# Altium schematic sheet AutoCar.SchDoc
size A3
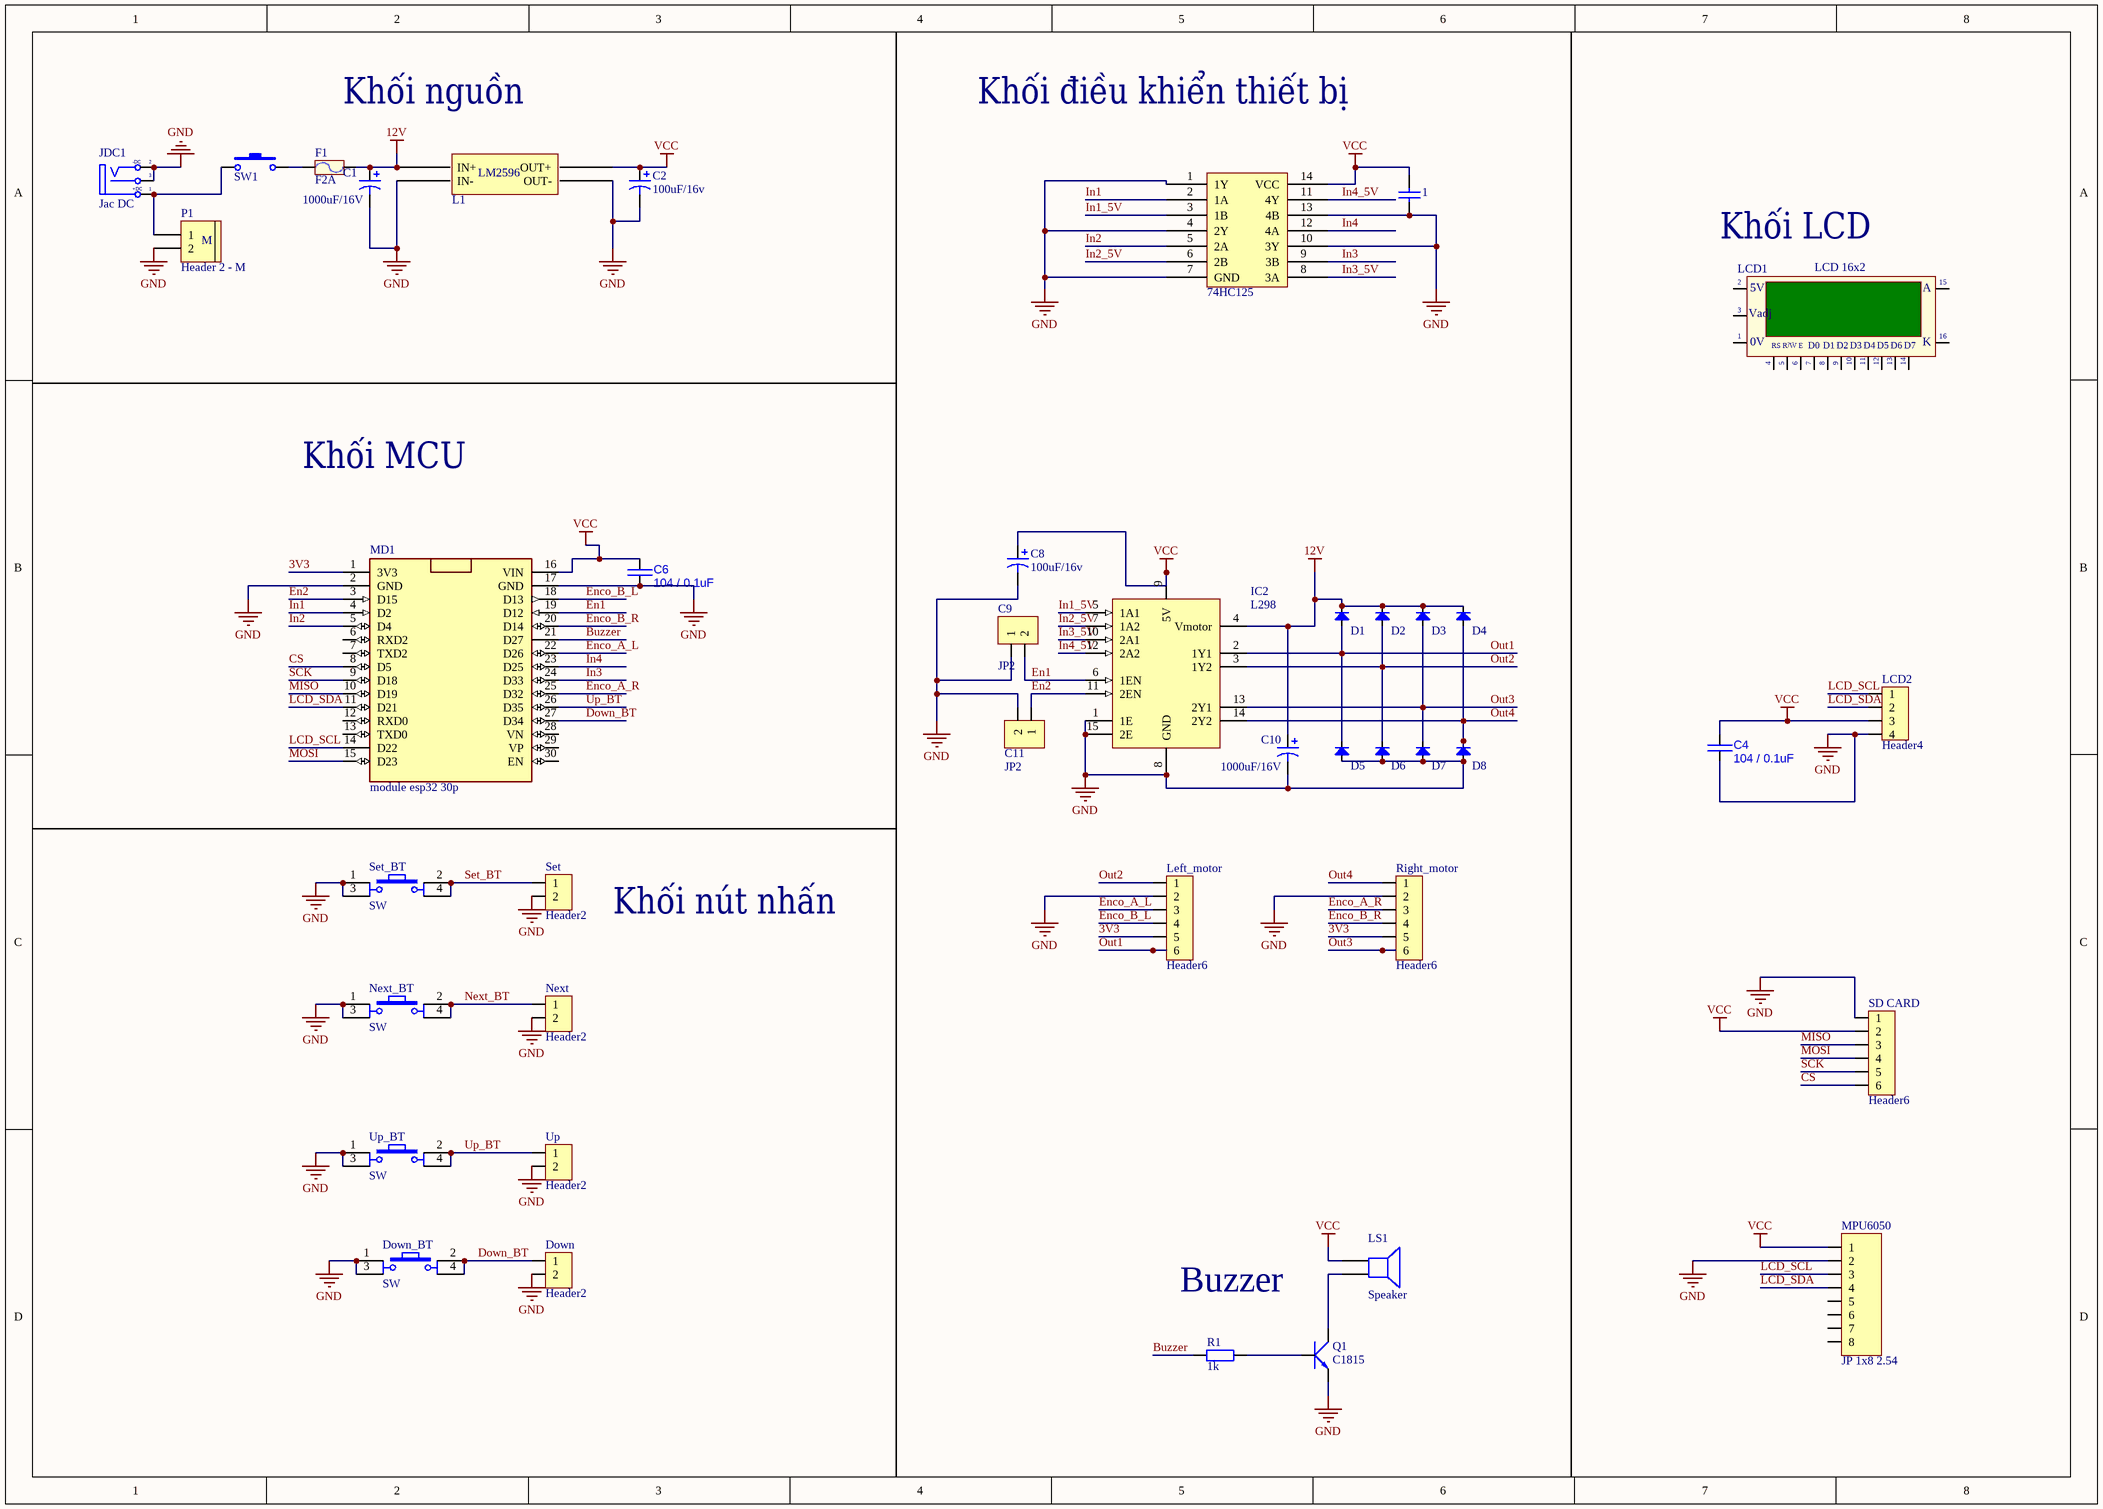
[diagram p0: AutoCar.SchDoc]

## Parts
1  Capacitor Ceramic  [C1206]  (value not drawn)
74HC125  74HC02 DIP14  [dip14]  (value not drawn)
C1  1000uF/16V  [C8mm]
C2  100uF/16v  [C5mm]
C4  value 104 / 0.1uF  [SMD Capacistor 1206]  (hidden comment: approved sub OK)
C6  value 104 / 0.1uF  [SMD Capacistor 1206]  (hidden comment: approved sub OK)
C8  100uF/16v  [C5mm]
C9  JP2  [JP2-CLOSED]
C10  1000uF/16V  [C8mm]
C11  JP2  [JP2-CLOSED]
D1  Diode SMD  [DIO-SMD-106]  (value not drawn)
D2  Diode SMD  [DIO-SMD-106]  (value not drawn)
D3  Diode SMD  [DIO-SMD-106]  (value not drawn)
D4  Diode SMD  [DIO-SMD-106]  (value not drawn)
D5  Diode SMD  [DIO-SMD-106]  (value not drawn)
D6  Diode SMD  [DIO-SMD-106]  (value not drawn)
D7  Diode SMD  [DIO-SMD-106]  (value not drawn)
D8  Diode SMD  [DIO-SMD-106]  (value not drawn)
Down  Header2  [Header2]
Down_BT  SW  [SW4]
F1  F2A  [Fuse]
IC2  L298  [DIP15SL2]
JDC1  Jac DC  [DC-IN]
L1  BUCK_LM2596  [BUCK_LM2596]  (value not drawn)
LCD1  LCD 16x2  [LCD16X2N]
LCD2  Header4  [XH2.54M-4]
Left_motor  Header6  [Header6]
LS1  Speaker  [SPEAKER]
MD1  module esp32 30p  [module esp32 30 pin]
MPU6050  JP 1x8 2.54  [JP 1x8 CT]
Next  Header2  [Header2]
Next_BT  SW  [SW4]
P1  Header 2 - M  [Medium - Header 2]
Q1  C1815  [SOT23B]
R1  1k  [RES-SMD-1206]
Right_motor  Header6  [Header6]
SD_CARD  Header6  [Header6]
Set  Header2  [Header2]
Set_BT  SW  [SW4]
SW1  KCD01-11_SWITCH  [KCD01-11]  (value not drawn)
Up  Header2  [Header2]
Up_BT  SW  [SW4]

## Nets
12V: C1.1 C10.1 D1.2(K) D2.2(K) D3.2(K) D4.2(K) F1.2 IC2.4(Vmotor) L1.1(IN+)
GND: 1.1 74HC125.1(1Y) 74HC125.4(2Y) 74HC125.7(GND) 74HC125.10(3Y) 74HC125.13(4B) C1.2 C2.2 C4.1 C6.1 C8.2 C9.1 C10.2 C11.2 D5.1(A) D6.1(A) D7.1(A) D8.1(A) Down.2 Down_BT.1 Down_BT.3 IC2.1(1E) IC2.8(GND) IC2.15(2E) JDC1.2(TN) JDC1.3(S) L1.2(IN-) L1.3(OUT-) LCD2.4 Left_motor.2 MD1.2(GND) MD1.17(GND) MPU6050.2 Next.2 Next_BT.1 Next_BT.3 P1.2 Q1.1(E) Right_motor.2 SD_CARD.1 Set.2 Set_BT.1 Set_BT.3 Up.2 Up_BT.1 Up_BT.3
VCC: 1.2 74HC125.14(VCC) C2.1 C4.2 C6.2 C8.1 IC2.9(5V) L1.4(OUT+) LCD2.3 LS1.1 MD1.16(VIN) MPU6050.1 SD_CARD.2
3V3: Left_motor.5 MD1.1(3V3) Right_motor.5
Buzzer: MD1.21(D27) R1.2
CS: MD1.8(D5) SD_CARD.6
Down_BT: Down.1 Down_BT.2 Down_BT.4 MD1.27(D34)
En1: C9.2 IC2.6(1EN) MD1.19(D12)
En2: C11.1 IC2.11(2EN) MD1.3(D15)
Enco_A_L: Left_motor.3 MD1.22(D26)
Enco_A_R: MD1.25(D32) Right_motor.3
Enco_B_L: Left_motor.4 MD1.18(D13)
Enco_B_R: MD1.20(D14) Right_motor.4
In1: 74HC125.2(1A) MD1.4(D2)
In1_5V: 74HC125.3(1B) IC2.5(1A1)
In2: 74HC125.5(2A) MD1.5(D4)
In2_5V: 74HC125.6(2B) IC2.7(1A2)
In3: 74HC125.9(3B) MD1.24(D33)
In3_5V: 74HC125.8(3A) IC2.10(2A1)
In4: 74HC125.12(4A) MD1.23(D25)
In4_5V: 74HC125.11(4Y) IC2.12(2A2)
LCD_SCL: LCD2.1 MD1.14(D22) MPU6050.3
LCD_SDA: LCD2.2 MD1.11(D21) MPU6050.4
MISO: MD1.10(D19) SD_CARD.3
MOSI: MD1.15(D23) SD_CARD.4
Next_BT: Next.1 Next_BT.2 Next_BT.4
Out1: D1.1(A) D5.2(K) IC2.2(1Y1) Left_motor.6
Out2: D2.1(A) D6.2(K) IC2.3(1Y2) Left_motor.1
Out3: D3.1(A) D7.2(K) IC2.13(2Y1) Right_motor.6
Out4: D4.1(A) D8.2(K) IC2.14(2Y2) Right_motor.1
SCK: MD1.9(D18) SD_CARD.5
Set_BT: Set.1 Set_BT.2 Set_BT.4
Up_BT: MD1.26(D35) Up.1 Up_BT.2 Up_BT.4
NetF1_1: F1.1 SW1.2
NetJDC1_1: JDC1.1(T) P1.1 SW1.1
NetLS1_2: LS1.2 Q1.2(C)
NetQ1_3: Q1.3(B) R1.1

Not connected (* = marked no-connect by the designer): LCD1 1(GND) 2(VDD) 3(VAdj) 4(RS) 5(R/~{W}) 6(~{EN}) 7(D0) 8(D1) 9(D2) 10(D3) 11(D4) 12(D5) 13(D6) 14(D7) 15(A) 16(K); MD1 6(RXD2) 7(TXD2) 12(RXD0) 13(TXD0) 28(VN) 29(VP) 30(EN); MPU6050 5 6 7 8

## Notes on the sheet
- Khối nguồn
- Khối điều khiển thiết bị
- (near LCD1) Khối LCD
- Khối MCU
- Khối nút nhấn
- Buzzer
- (in symbol BUCK_LM2596) LM2596
- (in symbol DCIN) -DC; +DC
- (in symbol Header 2 - M) M
- (in symbol LCD) 5V; Vadj; |; 0V; R/W; E

## Library data of the parts
1 = CapSMD: Capacitor; Value: 33p; Published: 8-Jun-2000; LatestRevisionDate: 17-Jul-2002; LatestRevisionNote: Re-released for DXP Platform.; PackageReference: RAD-0.3; Publisher: Altium Limited
74HC125 = 74HC02 DIP: Cắm; Don_Vi: Con; Ma_Hang: MH001521; Ten_Linh_Kien: 74HC02 DIP14; Ghi_Chu: *; Kieu_Chan: *; Chung_Loai: Cắm
C1 C10 = Cap Pol 12mm: Polarized Capacitor (Axial); Published: 8-Jun-2000; LatestRevisionDate: 17-Jul-2002; LatestRevisionNote: Re-released for DXP Platform.; PackageReference: POLAR0.8; Publisher: Altium Limited
C2 C8 = Cap Pol 5mm: Polarized Capacitor (Axial); Published: 8-Jun-2000; LatestRevisionDate: 17-Jul-2002; LatestRevisionNote: Re-released for DXP Platform.; PackageReference: POLAR0.8; Publisher: Altium Limited
C4 C6 = CAP C_0805: Capacitor SMD Cer 1.8nF 10% 50V X7R 0805; Manufacturer 1: AVX Corporation; Manufacturer Part Number 1: 08055C182KAT2A; Ratings: 50V; X7R; SCDType: source*; Tolerance: ±10%; Operating Temperature: -55°C ~ 125°C; Package / Case: 0805 (2012 metric); Supplier 1: Digi-Key; Supplier Part Number 1: 478-1374-1-ND
C9 C11 = JP2: WR-PHD 2.54 mm Angled Socket Header; Manufacturer: W¨¹rth Elektronik eiSos GmbH; partNo: 613002143121; ComponentLink1 Description: Manufacturer; ComponentLink2 Description: Datasheet; NoPins: 02; Created Date: 29 March 2013; ComponentLink1URL: http://www.we-online.com; ComponentLink2URL: http://katalog.we-online.de/em/datasheet/6130xx143121.pdf; Created by: Karrer Zheng
D1-D8 = Diode SMD: Default Diode; Code - JEDEC: DO-214-AB; Value: 1N5007; Published: 8-Jun-2000; Revision: July-2002: Re-released for DXP Platform.; Publisher: Altium Limited
Down Next Set Up = Header2: Header IDC, 2 x 1 Pin Vertical 2.54mm Pitch (Non-Boxed, Male); Manufacturer: W¨¹rth Elektronik eiSos GmbH; partNo: 613002143121; ComponentLink1 Description: Manufacturer; ComponentLink2 Description: Datasheet; NoPins: 02; Created Date: 29 March 2013; ComponentLink1URL: http://www.we-online.com; ComponentLink2URL: http://katalog.we-online.de/em/datasheet/6130xx143121.pdf; Created by: Karrer Zheng
Down_BT Next_BT Set_BT Up_BT = SW4: Switch button 4 pin; Value: Button chip 4 pin
F1 = Fuse: Designed by: VanDungEvn; Value: Fuse
IC2 = L298: Dual Full-H Driver; Note: The tab is elec is connected to GND pin; Published: 15-May-2002; DatasheetVersion: Jun-1990; PackageReference: KV015; Publisher: Altium Limited; PackageDescription: TO, Thru-Hole, Vertical, Heatsink Mounted; 15 Bent Staggered Leads; Pitch 1.27 mm; ComponentLink1Description: Manufacturer Link; ComponentLink1URL: http://www.ti.com/
JDC1 = DCIN: Jac DC input; Value: Jac DC
LCD1 = LCD
LCD2 = Header4: Header IDC, 4 x 1 Pin Vertical 2.54mm Pitch (Non-Boxed, Male); Manufacturer: W¨¹rth Elektronik eiSos GmbH; partNo: 613002143121; ComponentLink1 Description: Manufacturer; ComponentLink2 Description: Datasheet; NoPins: 02; Created Date: 29 March 2013; ComponentLink1URL: http://www.we-online.com; ComponentLink2URL: http://katalog.we-online.de/em/datasheet/6130xx143121.pdf; Created by: Karrer Zheng
Left_motor Right_motor SD_CARD = Header6: Header IDC, 6 x 1 Pin Vertical 2.54mm Pitch (Non-Boxed, Male); Manufacturer: W¨¹rth Elektronik eiSos GmbH; partNo: 613002143121; ComponentLink1 Description: Manufacturer; ComponentLink2 Description: Datasheet; NoPins: 02; Created Date: 29 March 2013; ComponentLink1URL: http://www.we-online.com; ComponentLink2URL: http://katalog.we-online.de/em/datasheet/6130xx143121.pdf; Created by: Karrer Zheng
LS1 = Speaker: Loudspeaker; Published: 24-Mar-1999; LatestRevisionDate: 17-Jul-2002; LatestRevisionNote: Re-released for DXP Platform.; PackageReference: PIN2; Publisher: Altium Limited
MPU6050 = JP 1x8 2.54 Cai Thang: Cắm; Ten_Linh_Kien: Jump Đơn Cái 2.54MM 1x20P Thẳng; Don_Vi: Con; Ma_Hang: MH004006; Ghi_Chu: *; Kieu_Chan: *; Chung_Loai: Cắm
P1 = Header 2 - M: Header, 2-Pin, Medium; LatestRevisionDate: 17-Jul-2002; LatestRevisionNote: Re-released for DXP Platform.; Publisher: Altium Limited
Q1 = C1815: NPN 600mW, ECB; Value: C1815
R1 = R0805: Resistor SMD 0805; Published: 8-Jun-2000; LatestRevisionDate: 17-Jul-2002; LatestRevisionNote: Re-released for DXP Platform.; PackageReference: AXIAL-0.4; Publisher: Altium Limited
SW1 = KCD01-11_SWITCH: Nut Nhan 2 Chan SMD 3x6x2.5; Ma_Hang: MH001036; Ten: Nút Nhấn 2 Chân 3x6x2.5MM SMD